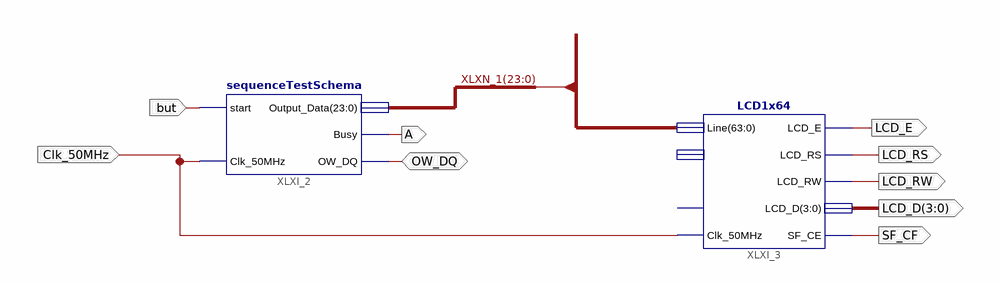
[diagram p0: schematic sheet 1]
// Xilinx ISE schematic sgfsfgsf.sch (spartan3e) as structural Verilog: 2 symbols, 9 ports
module sgfsfgsf (
  input  Clk_50MHz,
  input  but,
  inout  OW_DQ,
  output A,
  output LCD_E,
  output LCD_RS,
  output LCD_RW,
  output SF_CF,
  output [3:0] LCD_D
);

  wire [63:0] XLXN_1;

  sequenceTestSchema XLXI_2 (.start(but), .Clk_50MHz(Clk_50MHz), .Output_Data(XLXN_1[23:0]), .Busy(A), .OW_DQ(OW_DQ));
  LCD1x64 XLXI_3 (
    .Clk_50MHz(Clk_50MHz), .Line(XLXN_1), .LCD_D(LCD_D), .LCD_E(LCD_E), .LCD_RW(LCD_RW), .LCD_RS(LCD_RS),
    .SF_CE(SF_CF));  // open: Reset, Blank
endmodule
